# Altium schematic sheet keyboard-Left.SchDoc
size 420 x 297 mm; SheetNumber: 2; SheetTotal: 11; SPICEModelCacheCUGXHSME: <root> / <DocumentId>CUGXHSME</DocumentId> / <CacheFrame Number="0"> / <Model Name="0603_885012206020_100nf" Kind="CKT"> / <Text>******* / .subckt 0603_885012206020_100nF 1 2 / Rser 1 3 0.0188883213835 / Lser 2 4 4.53593763E-10 / C1 3 4 0.0000001 / Rpar 3 4 5000000000 / .ends 0603_885012206020_100nF</Text> / </Model> / </CacheFrame> / </root>
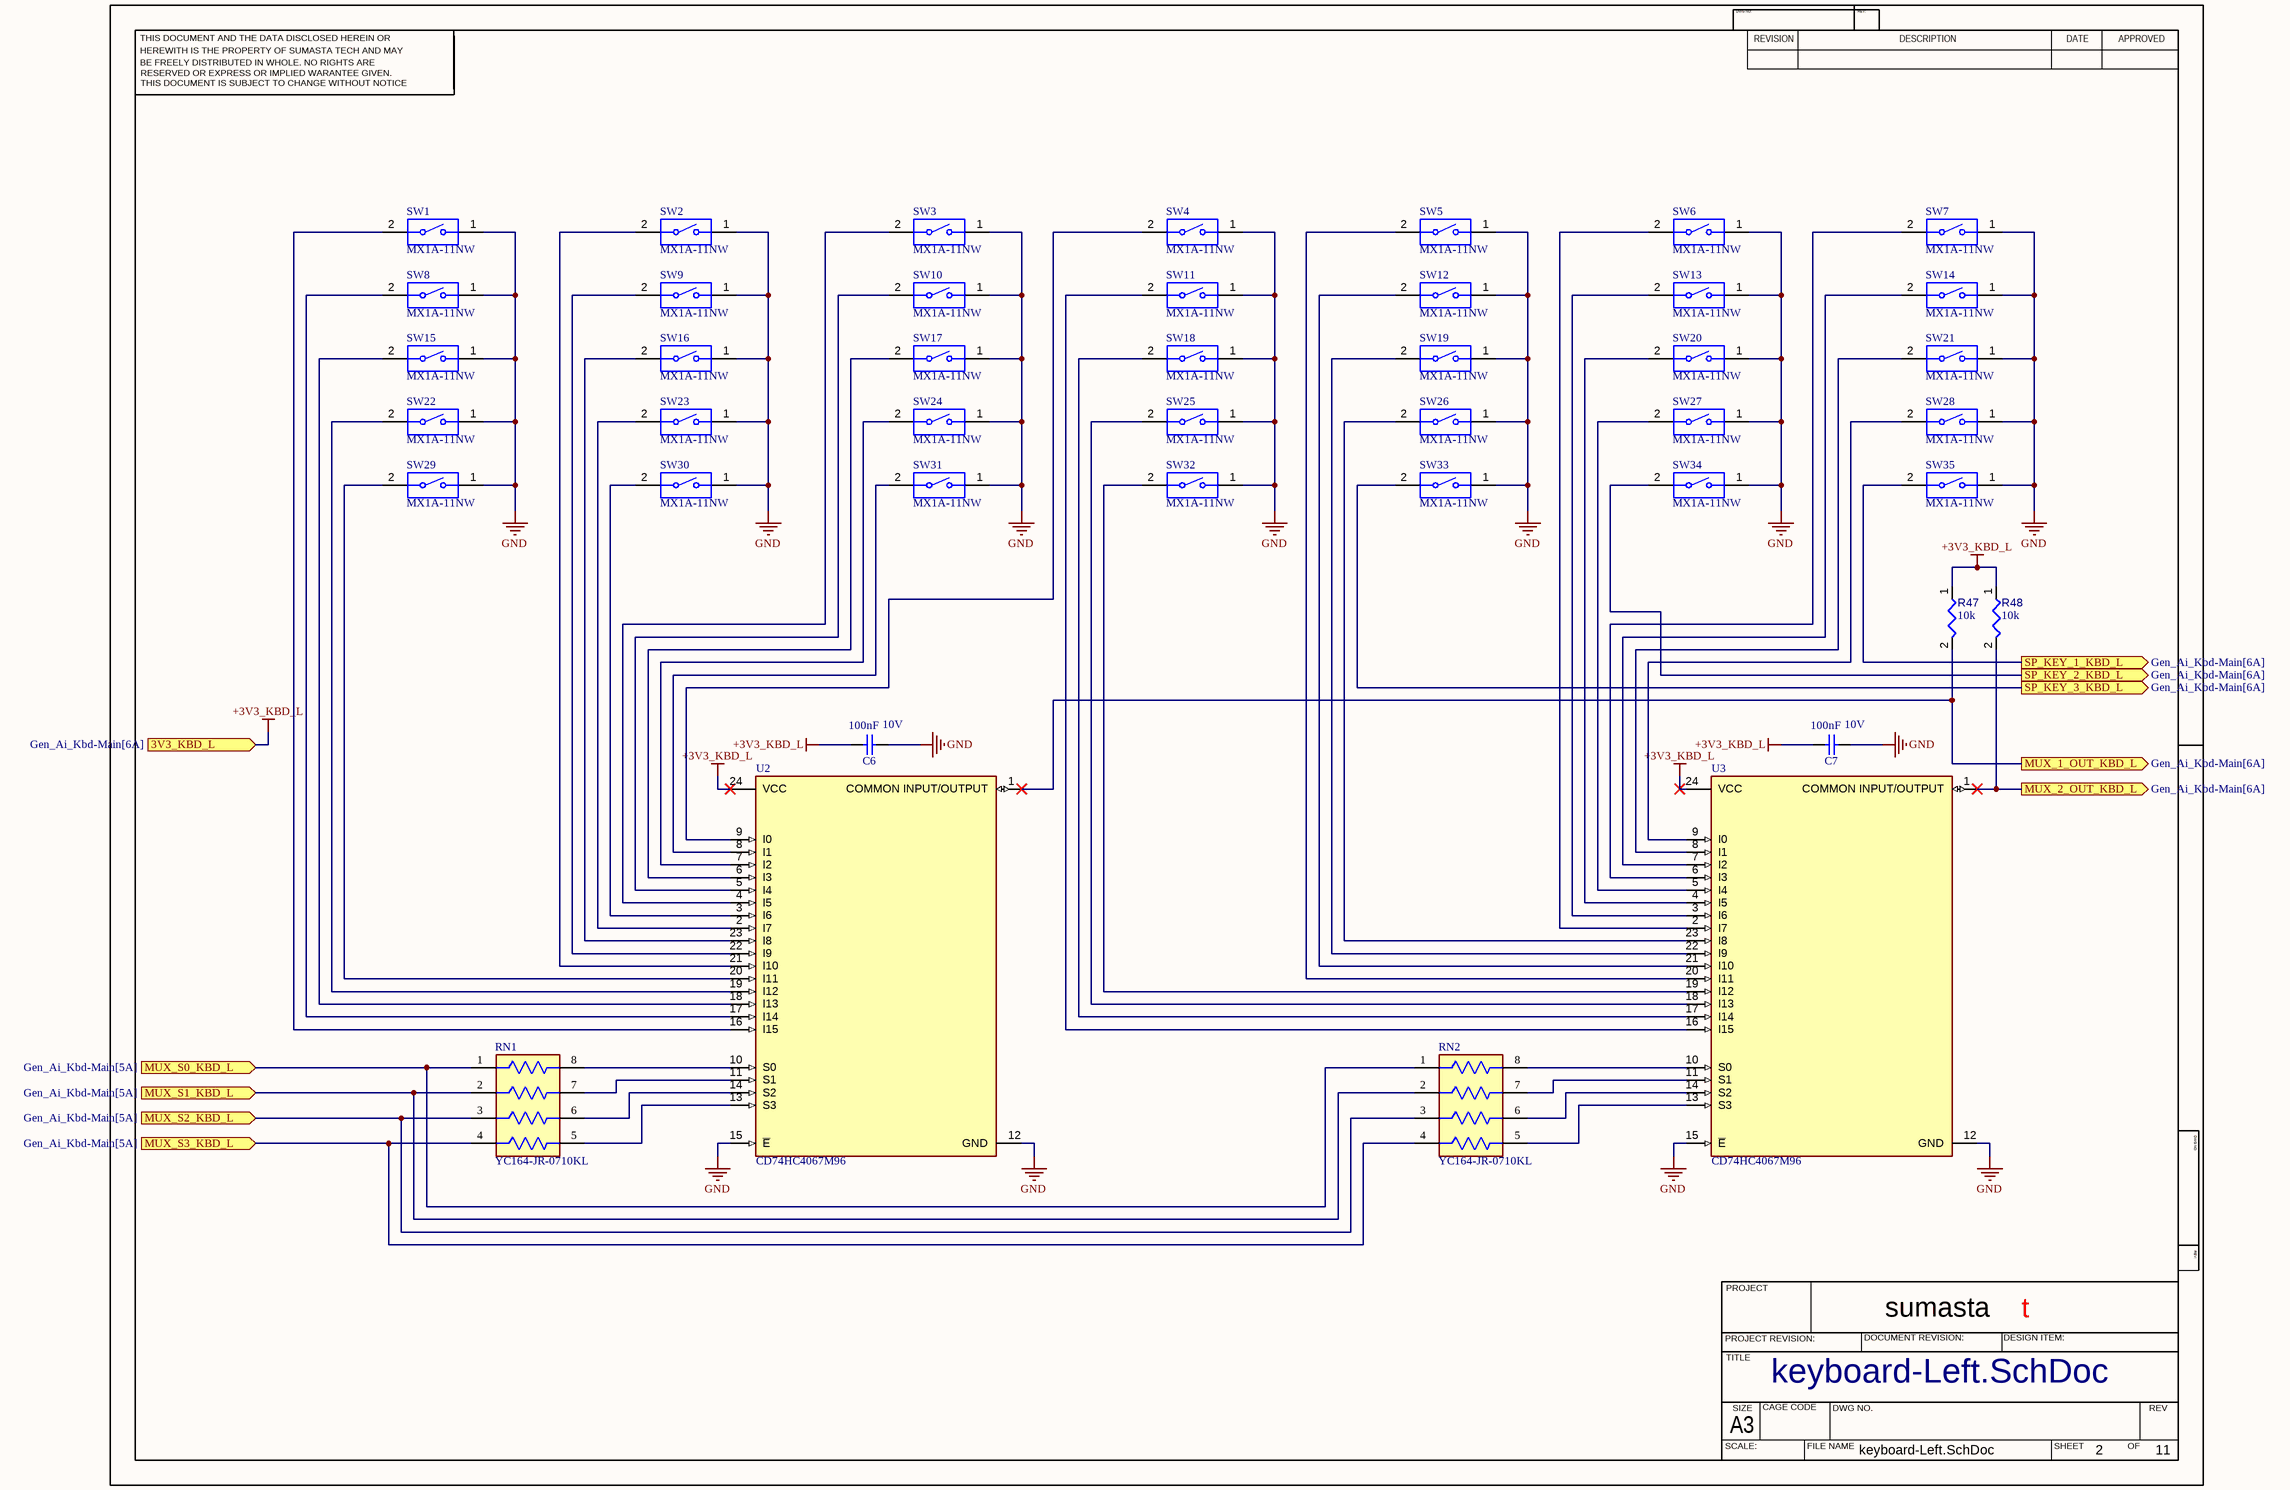
[diagram p0: keyboard-Left.SchDoc]

## Parts
C6  Rated Voltage (DC): 10V  Capacitance: 100nF  [WCAP-CSGP_0603_L1.6W0.8H0.8_Reflow]  (hidden comment: 885012206020)
C7  Rated Voltage (DC): 10V  Capacitance: 100nF  [WCAP-CSGP_0603_L1.6W0.8H0.8_Reflow]  (hidden comment: 885012206020)
R47  value 10k  [RESC1608X55X25ML10T15]  (hidden comment: Resistor 10k +/-1% 0603 100 mW)
R48  value 10k  [RESC1608X55X25ML10T15]  (hidden comment: Resistor 10k +/-1% 0603 100 mW)
RN1  YC164-JR-0710KL  [FP-YC164-MFG]
RN2  YC164-JR-0710KL  [FP-YC164-MFG]
SW1  MX1A-11NW  [CHRY-MX1A-11NW_V]
SW2  MX1A-11NW  [CHRY-MX1A-11NW_V]
SW3  MX1A-11NW  [CHRY-MX1A-11NW_V]
SW4  MX1A-11NW  [CHRY-MX1A-11NW_V]
SW5  MX1A-11NW  [CHRY-MX1A-11NW_V]
SW6  MX1A-11NW  [CHRY-MX1A-11NW_V]
SW7  MX1A-11NW  [CHRY-MX1A-11NW_V]
SW8  MX1A-11NW  [CHRY-MX1A-11NW_V]
SW9  MX1A-11NW  [CHRY-MX1A-11NW_V]
SW10  MX1A-11NW  [CHRY-MX1A-11NW_V]
SW11  MX1A-11NW  [CHRY-MX1A-11NW_V]
SW12  MX1A-11NW  [CHRY-MX1A-11NW_V]
SW13  MX1A-11NW  [CHRY-MX1A-11NW_V]
SW14  MX1A-11NW  [CHRY-MX1A-11NW_V]
SW15  MX1A-11NW  [CHRY-MX1A-11NW_V]
SW16  MX1A-11NW  [CHRY-MX1A-11NW_V]
SW17  MX1A-11NW  [CHRY-MX1A-11NW_V]
SW18  MX1A-11NW  [CHRY-MX1A-11NW_V]
SW19  MX1A-11NW  [CHRY-MX1A-11NW_V]
SW20  MX1A-11NW  [CHRY-MX1A-11NW_V]
SW21  MX1A-11NW  [CHRY-MX1A-11NW_V]
SW22  MX1A-11NW  [CHRY-MX1A-11NW_V]
SW23  MX1A-11NW  [CHRY-MX1A-11NW_V]
SW24  MX1A-11NW  [CHRY-MX1A-11NW_V]
SW25  MX1A-11NW  [CHRY-MX1A-11NW_V]
SW26  MX1A-11NW  [CHRY-MX1A-11NW_V]
SW27  MX1A-11NW  [CHRY-MX1A-11NW_V]
SW28  MX1A-11NW  [CHRY-MX1A-11NW_V]
SW29  MX1A-11NW  [CHRY-MX1A-11NW_V]
SW30  MX1A-11NW  [CHRY-MX1A-11NW_V]
SW31  MX1A-11NW  [CHRY-MX1A-11NW_V]
SW32  MX1A-11NW  [CHRY-MX1A-11NW_V]
SW33  MX1A-11NW  [CHRY-MX1A-11NW_V]
SW34  MX1A-11NW  [CHRY-MX1A-11NW_V]
SW35  MX1A-11NW  [CHRY-MX1A-11NW_V]
U2  CD74HC4067M96  [FP-DW0024A-MFG]
U3  CD74HC4067M96  [FP-DW0024A-MFG]

## Ports
3V3_KBD_L (in, see Gen_Ai_Kbd-Main[6A]), MUX_1_OUT_KBD_L (out, see Gen_Ai_Kbd-Main[6A]), MUX_2_OUT_KBD_L (out, see Gen_Ai_Kbd-Main[6A]), MUX_S0_KBD_L (in, see Gen_Ai_Kbd-Main[5A]), MUX_S1_KBD_L (in, see Gen_Ai_Kbd-Main[5A]), MUX_S2_KBD_L (in, see Gen_Ai_Kbd-Main[5A]), MUX_S3_KBD_L (in, see Gen_Ai_Kbd-Main[5A]), SP_KEY_1_KBD_L (out, see Gen_Ai_Kbd-Main[6A]), SP_KEY_2_KBD_L (out, see Gen_Ai_Kbd-Main[6A]), SP_KEY_3_KBD_L (out, see Gen_Ai_Kbd-Main[6A])

## Nets
+3V3_KBD_L: C6.1 C7.1 R47.1 R48.1 U2.24(VCC) U3.24(VCC) ; port 3V3_KBD_L
GND: C6.2 C7.2 SW1.1 SW2.1 SW3.1 SW4.1 SW5.1 SW6.1 SW7.1 SW8.1 SW9.1 SW10.1 SW11.1 SW12.1 SW13.1 SW14.1 SW15.1 SW16.1 SW17.1 SW18.1 SW19.1 SW20.1 SW21.1 SW22.1 SW23.1 SW24.1 SW25.1 SW26.1 SW27.1 SW28.1 SW29.1 SW30.1 SW31.1 SW32.1 SW33.1 SW34.1 SW35.1 U2.12(GND) U2.15(~{E}) U3.12(GND) U3.15(~{E})
MUX_1_OUT_KBD_L: R47.2 U2.1(COMMON_INPUT/OUTPUT) ; port MUX_1_OUT_KBD_L
MUX_2_OUT_KBD_L: R48.2 U3.1(COMMON_INPUT/OUTPUT) ; port MUX_2_OUT_KBD_L
MUX_S0_KBD_L: RN1.1 RN2.1 ; port MUX_S0_KBD_L
MUX_S1_KBD_L: RN1.2 RN2.2 ; port MUX_S1_KBD_L
MUX_S2_KBD_L: RN1.3 RN2.3 ; port MUX_S2_KBD_L
MUX_S3_KBD_L: RN1.4 RN2.4 ; port MUX_S3_KBD_L
SP_KEY_1_KBD_L: SW35.2 ; port SP_KEY_1_KBD_L
SP_KEY_2_KBD_L: SW34.2 ; port SP_KEY_2_KBD_L
SP_KEY_3_KBD_L: SW33.2 ; port SP_KEY_3_KBD_L
NetRN1_5: RN1.5 U2.13(S3)
NetRN1_6: RN1.6 U2.14(S2)
NetRN1_7: RN1.7 U2.11(S1)
NetRN1_8: RN1.8 U2.10(S0)
NetRN2_5: RN2.5 U3.13(S3)
NetRN2_6: RN2.6 U3.14(S2)
NetRN2_7: RN2.7 U3.11(S1)
NetRN2_8: RN2.8 U3.10(S0)
NetSW1_2: SW1.2 U2.16(I15)
NetSW2_2: SW2.2 U2.21(I10)
NetSW3_2: SW3.2 U2.4(I5)
NetSW4_2: SW4.2 U2.9(I0)
NetSW5_2: SW5.2 U3.20(I11)
NetSW6_2: SW6.2 U3.2(I7)
NetSW7_2: SW7.2 U3.6(I3)
NetSW8_2: SW8.2 U2.17(I14)
NetSW9_2: SW9.2 U2.22(I9)
NetSW10_2: SW10.2 U2.5(I4)
NetSW11_2: SW11.2 U3.16(I15)
NetSW12_2: SW12.2 U3.21(I10)
NetSW13_2: SW13.2 U3.3(I6)
NetSW14_2: SW14.2 U3.7(I2)
NetSW15_2: SW15.2 U2.18(I13)
NetSW16_2: SW16.2 U2.23(I8)
NetSW17_2: SW17.2 U2.6(I3)
NetSW18_2: SW18.2 U3.17(I14)
NetSW19_2: SW19.2 U3.22(I9)
NetSW20_2: SW20.2 U3.4(I5)
NetSW21_2: SW21.2 U3.8(I1)
NetSW22_2: SW22.2 U2.19(I12)
NetSW23_2: SW23.2 U2.2(I7)
NetSW24_2: SW24.2 U2.7(I2)
NetSW25_2: SW25.2 U3.18(I13)
NetSW26_2: SW26.2 U3.23(I8)
NetSW27_2: SW27.2 U3.5(I4)
NetSW28_2: SW28.2 U3.9(I0)
NetSW29_2: SW29.2 U2.20(I11)
NetSW30_2: SW30.2 U2.3(I6)
NetSW31_2: SW31.2 U2.8(I1)
NetSW32_2: SW32.2 U3.19(I12)

## Notes on the sheet
- THIS DOCUMENT AND THE DATA DISCLOSED HEREIN OR
- HEREWITH IS THE PROPERTY OF SUMASTA TECH AND MAY
- DWG NO:
- REVISION
- REV:
- DESCRIPTION
- DATE
- APPROVED
- BE FREELY DISTRIBUTED IN WHOLE. NO RIGHTS ARE
- THIS DOCUMENT IS SUBJECT TO CHANGE WITHOUT NOTICE
- RESERVED OR EXPRESS OR IMPLIED WARANTEE GIVEN.
- PROJECT
- sumasta
- t
- PROJECT REVISION:
- TITLE
- DOCUMENT REVISION:
- DESIGN ITEM:
- SCALE:
- A3
- SIZE
- CAGE CODE
- FILE NAME
- DWG NO.
- SHEET
- OF
- REV

## Library data of the parts
C6 C7 = CMP-007-000576-1: WCAP-CSGP Multilayer Ceramic Chip Capacitor, General Purpose, size 0603, X7R, 100nF, 10VDC; Manufacturer: Wurth Elektronik; Case/Size Code: 0603; Capacitance Tolerance: +/-10%; Technical Reference: X7R0603104K010DFCT10000; Insulation Resistance: 5GO; Dissipation Factor: 5%; Operating Temperature Min: -55°C; Packaging: Tape and Reel; Manufacturer Part Number: 885012206020; Source: WCAP-CSGP.SchLib; ComponentLink1Description: Website Link; Ceramic Type: X7R; Component Type: Standard; Height: 0.8mm; ComponentLink2URL: https://www.we-online.com/redexpert/spec/885012206020?ad; Mount: Surface Mount; Length: 1.6mm; Pin Count: 2; Design Item ID: 885012206020; ComponentLink1URL: https://www.we-online.com/redexpert/article/885012206020?ad; Width: 0.8mm; Operating Temperature Max: 125°C; Category: Multilayer Ceramic Chip Capacitors; Match Code: WCAP-CSGP; ComponentLink2Description: Datasheet Link
R47 R48 = CMP-009-00017-5: Chip Resistor, 10 KOhm, +/- 1%, 01 W, -55 to 155 degC, 0603 (1608 Metric); Voltage Rating: 50V; Power: 100mW; RoHS Compliant: True; Min Operating Temperature: -55°C; Pins: 2; Case/Package: 0603; Mounting Technology: SM; Max Operating Temperature: 155°C; Tolerance: 1%
RN1 RN2 = CMP-03411-000003-1: RES ARRAY 4 RES 10K OHM 1206; Resistance Tolerance: 5%; Power Per Element: 62.5mW; Number of Circuits: 4; Number of Terminals/Pins: 8; Voltage Rating: 50V; Resistance: 10kR; Circuit Type: Isolated; Tolerance: 1%; Temperature Coefficient: 200ppm/°C; Depth: 1.6mm; Termination: SMD/SMT; Technology: THICK FILM; Lead Free: Lead Free; Min Operating Temperature: -55°C; Number of Elements: 4; Series: YC164; Radiation Hardening: No; Length: 0.126inch; Width: 0.063inch; Case Code (Metric): 3216; Number of Pins: 8; Package Quantity: 5000; Number of Contacts: 8; Working Voltage: 50V; Packaging: Tape and Reel; Height: 0.028inch; Mount: Surface Mount; Number of Resistors: 4; Case Code (Imperial): 1206; Size Code: 0603; Terminal Pitch: 0.8mm; Military Standard: Not; Power Dissipation: 62.5mW; Case/Package: 0164; RoHS Compliant: Yes; Max Operating Temperature: 155°C
SW1-SW35 = CMP-011-00013-1: Switch Key N.O. SPST 0.01A 12VAC 12VDC 0.58N PC Pins 50000000Cycles Thru-Hole
U2 U3 = CMP-04901-000007-1: IC MUX/DEMUX 1X16 24SOIC; Manufacturer: Texas Instruments; Standoff Height: 0.1mm; Logic Function Desc: Non-Inverting; Max Supply Voltage: 6V; Number Of Inputs: 16; Quiescent Current: 8uA; Number Of Circuits: 1; Propagation Delay: 6ns; Max Junction Temp: +150°C; Min Supply Voltage: 2V; ComponentLink2Description: Datasheet; Octopart: https://octopart.com/cd74hc4067m96-texas+instruments-722802; Ambient Temperature Range High: +125°C; Ipc Land Pattern Name: SOIC127P1030X265-24; Height: 2.65mm; Mouser Description: Multiplexer Switch ICs Hi-Spd CMOS 16Ch Anl Mltplxr/Demltplxr; Temperature Range Low: -55°C; Package: DW0024A; Temperature Range High: +125°C; Lead Free: Yes; ComponentLink2URL: http://www.ti.com/lit/ds/symlink/cd74hc4067.pdf; Manufacturer Part Number: CD74HC4067M96; RoHS: TRUE; Automotive: No; Device Class L1: Integrated Circuits (ICs); Digikey Description: IC MUX/DEMUX 1X16 24SOIC; Device Class L2: Logic ICs; Temperature: -55°C to +125°C; Device Class L3: Multiplexers; Category: IC; Ambient Temperature Range Low: -55°C; Number Of Outputs: 1